# Altium schematic sheet pca10171_memory.SchDoc: =BoardTitle + ' - Memory'
size A3; Organization: Nordic Semiconductor; DocumentNumber: 6; SheetNumber: 6; SheetTotal: 10; CompanyName: Nordic Semiconductor; DocumentSize: A3
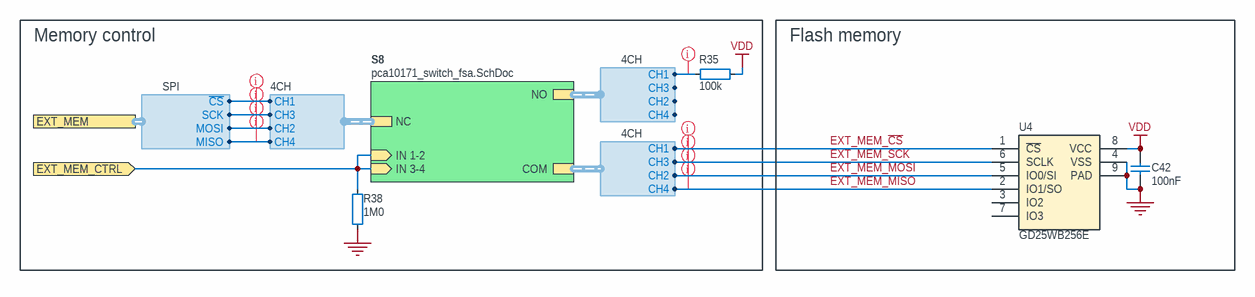
[diagram p0: pca10171_memory.SchDoc]

## Parts
C42  100nF  [CAPC0603X03L_C]
R35  100k  [RESC0603X03L_C]
R38  1M0  [RESC0603X03L_C]
U4  GD25WB256E  [SON127P800X80_HS-9N]

## Blocks framed on the sheet
Memory control: R35 R38
Flash memory: C42 U4

## Sub-sheets
S8 = pca10171_switch_fsa.SchDoc: IN 1-2 (in), COM (harness 4CH), NC (harness 4CH), NO (harness 4CH), IN 3-4 (in)

## Ports
EXT_MEM (harness SPI), EXT_MEM_CTRL (in)

## Harnesses
4CH: CH1, CH2, CH3, CH4
SPI: SCK, ~{CS}, MOSI, MISO

## Nets
GND: C42.1 R38.1 U4.4(VSS) U4.9(PAD)
VDD: C42.2 R35.2 U4.8(VCC)
EXT_MEM_~{CS}: U4.1(~{CS}) ; sheet S8/COM.CH1
EXT_MEM_CTRL: R38.2 ; port EXT_MEM_CTRL, sheet S8/IN 1-2, sheet S8/IN 3-4
EXT_MEM_MISO: U4.2(IO1/SO) ; sheet S8/COM.CH4
EXT_MEM_MOSI: U4.5(IO0/SI) ; sheet S8/COM.CH2
EXT_MEM_SCK: U4.6(SCLK) ; sheet S8/COM.CH3
NetR35_1: R35.1 ; sheet S8/NO.CH1
(unnamed): port EXT_MEM.SCK, sheet S8/NC.CH3
(unnamed): port EXT_MEM.~{CS}, sheet S8/NC.CH1
(unnamed): port EXT_MEM.MOSI, sheet S8/NC.CH2
(unnamed): port EXT_MEM.MISO, sheet S8/NC.CH4

Not connected (* = marked no-connect by the designer): U4 3(IO2) 7(IO3)

## Layout directives
net class GPIO: (no net found under the mark), EXT_MEM_MISO, EXT_MEM_MOSI, EXT_MEM_SCK, EXT_MEM_~{CS}, NetR35_1

## Notes on the sheet
- Title
- Size
- Date:
- File:
- A3
- PCB Assembly Number
- Sheet         of
- Drawn By:
- Revision
- Classification:

## Library data of the parts
C42 = C0201-100n: Capacitor, X5R, ±10%; Manufacturer: N.A.; Part number IPS: 00000001248, 00000002505; Part number Norautron: 262071862; Part number NEMS: 100200078; Note: 16V; Pad Count: 2; Component Status: Active; Part Number: C0201-100n; Manufacturer Part Number: N.A.; LatestRevisionDate: 2017-11-09; Published: 2014-11-13; Value: 100nF; Artikkelnr Noca: N.A.; Footprint Doc: 0201; ComponentLink1URL: N.A.; ComponentLink1Description: Datasheet; ComponentLink2URL: N.A.; ComponentLink2Description: Supplier link; HelpURL: N.A.; Supplier 1: N.A.; Supplier Part Number 1: N.A.; Supplier 2: N.A.; Supplier Part Number 2: N.A.; PartId: 100200078; Component Class: Capacitors; Author: rsk
R35 = R0201-100k: Resistor, ±1%, 0.05W; Manufacturer: N.A.; Part number IPS: 00000001419; Part number Norautron: 26108487; Part number NEMS: 100100080; Pad Count: 2; Note: Chip Res 1%; Component Status: Active; Part Number: R0201-100k; PartId: 100100080; Component Class: Resistors; Author: rsk; Manufacturer Part Number: N.A.; ComponentLink1URL: N.A.; ComponentLink1Description: Datasheet; ComponentLink2URL: N.A.; ComponentLink2Description: Supplier link; HelpURL: N.A.; Footprint Doc: 0201; LatestRevisionDate: 2014-11-13; Published: 2014-11-13; Value: 100k; Supplier 1: N.A.; Supplier Part Number 1: N.A.; Supplier 2: N.A.; Supplier Part Number 2: N.A.; Artikkelnr Noca: N.A.
R38 = R0201-1M0: Resistor, ±1%, 0.05W; Manufacturer: N.A.; Part number IPS: 00000001418; Part number Norautron: 26107108; Part number NEMS: 100100093; Note: Chip Res 1%; Pad Count: 2; Component Status: Active; Part Number: R0201-1M0; Manufacturer Part Number: N.A.; ComponentLink1URL: N.A.; ComponentLink1Description: Datasheet; ComponentLink2URL: N.A.; ComponentLink2Description: Supplier link; HelpURL: N.A.; Footprint Doc: 0201; LatestRevisionDate: 2014-11-13; Published: 2014-11-13; Value: 1M0; Artikkelnr Noca: N.A.; Supplier 1: N.A.; Supplier Part Number 1: N.A.; Supplier 2: N.A.; Supplier Part Number 2: N.A.; PartId: 100100093; Component Class: Resistors; Author: rsk
U4 = GD25WB256EYIG: Quad Serial Flash, 256Mbit, 104MHz, 1.65V - 3.6V; Manufacturer: GigaDevice; Part number NEMS: 101900774; Note: N.A.; Pad Count: 8; Component Status: Active; Part Number: GD25WB256EYIG; Manufacturer Part Number: GD25WB256EYIG; Footprint Doc: WSON-8; LatestRevisionDate: 2023-03-27; Published: 2023-03-27; Value: GD25WB256E; Artikkelnr Noca: N.A.; Part number IPS: N.A.; ComponentLink1URL: https://www.gigadevice.com.cn/Public/Uploads/uploadfile/files/20220714/DS-00863-GD25WB256E-Rev1.1.pdf; ComponentLink1Description: Datasheet; ComponentLink2URL: N.A.; ComponentLink2Description: Supplier link; HelpURL: https://www.gigadevice.com/product/flash/product-series/spi-nor-flash/gd25wb256e.html; Supplier 1: N.A.; Supplier Part Number 1: N.A.; Supplier 2: N.A.; Supplier Part Number 2: N.A.; Author: rubr; Component Class: Misc_ICs; Part number Norautron: N.A.; PartId: 101900774